# EAGLE design ADC_CPLDV9 (EAGLE 9.3.2)
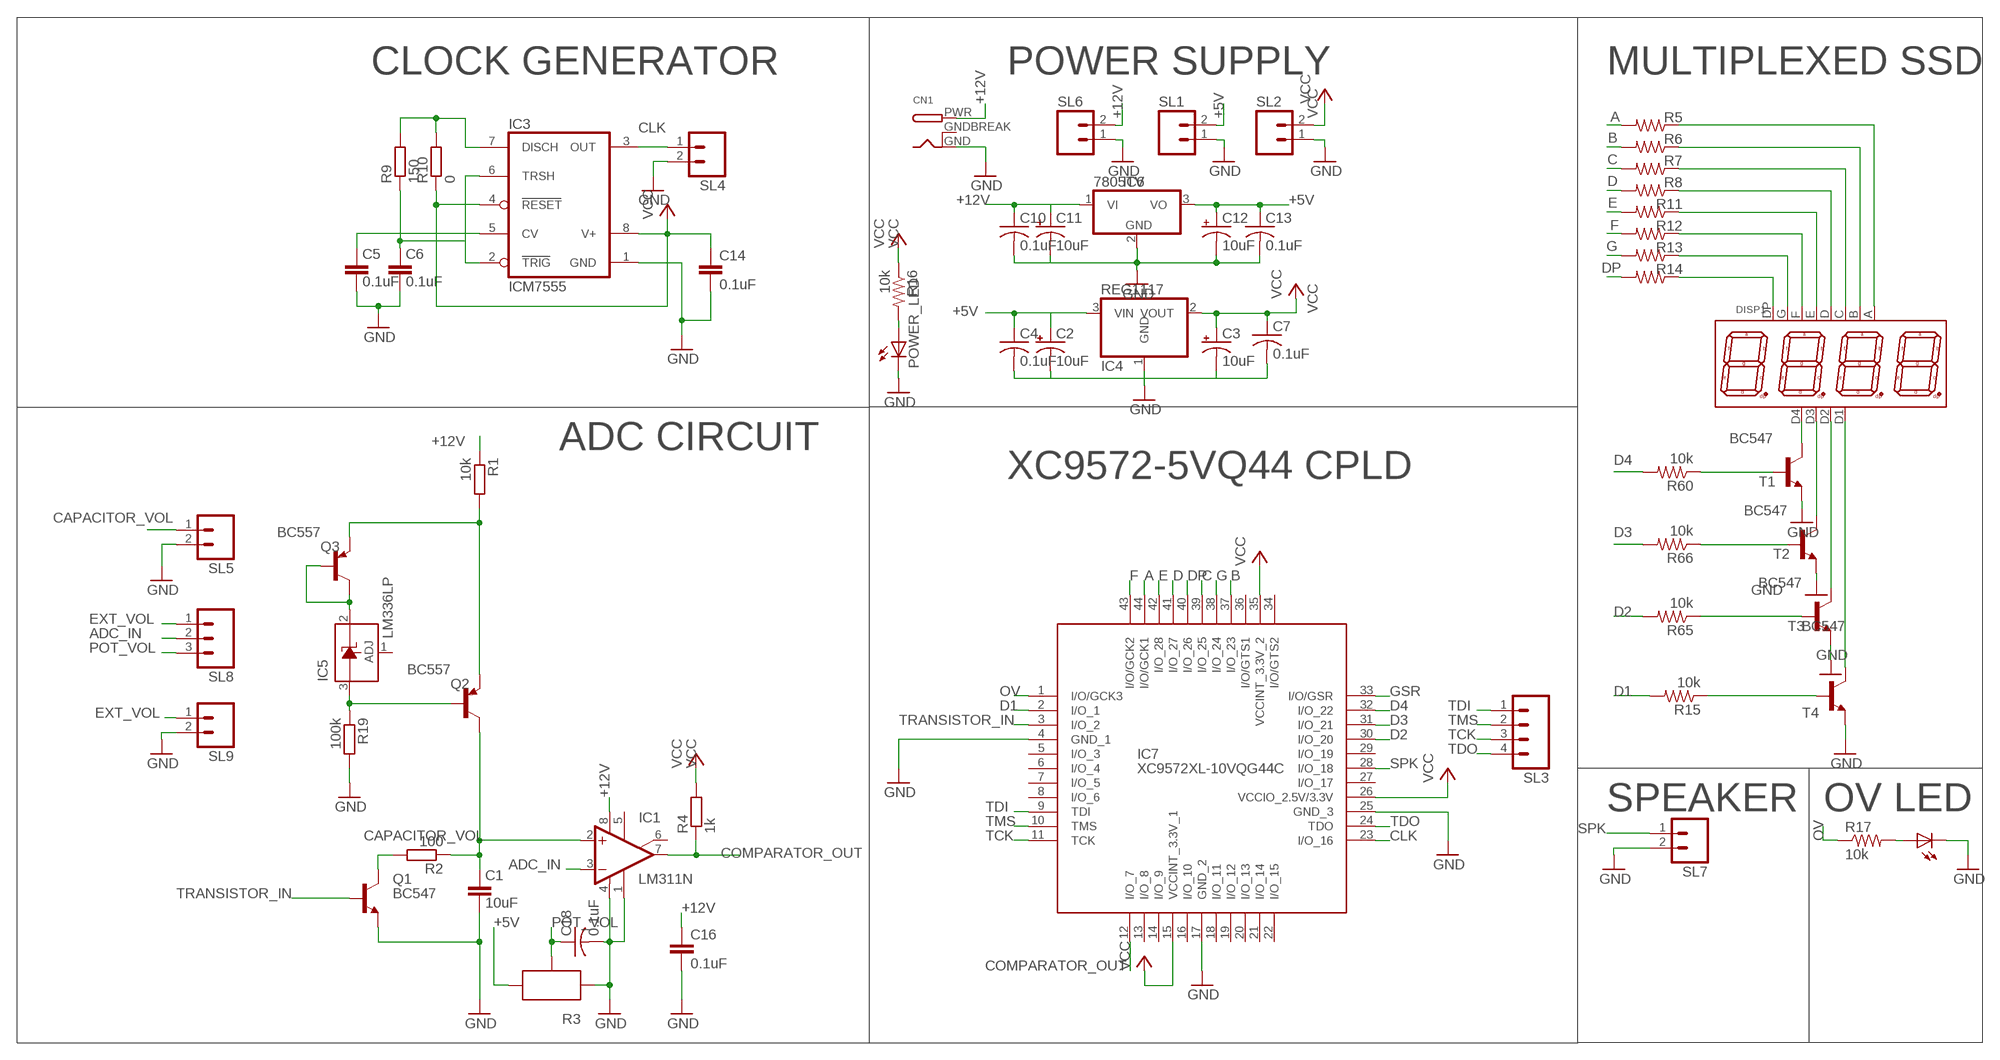
[diagram p0: schematic, sheet 1]

## Parts
C1  10uF  C-EU025-025X050  [C025-025X050]
C2  10uF  CPOL-USB/3528-21R  [B/3528-21R]
C3  10uF  CPOL-USB/3528-21R  [B/3528-21R]
C4  0.1uF  C-USC0805  [C0805]
C5  0.1uF  C-EU025-024X044  [C025-024X044]
C6  0.1uF  C-EU025-024X044  [C025-024X044]
C7  0.1uF  C-USC0805  [C0805]
C10  0.1uF  C-USC0805  [C0805]
C11  10uF  CPOL-USB/3528-21R  [B/3528-21R]
C12  10uF  CPOL-USB/3528-21R  [B/3528-21R]
C13  0.1uF  C-USC0805  [C0805]
C14  0.1uF  C-EU025-025X050  [C025-025X050]
C16  0.1uF  C-EU025-025X050  [C025-025X050]
C18  0.1uF  C-USC0805  [C0805]
CN1  DCBARRELPTH  [DCJACK_2MM_PTH]
DISP1  7-SEG_4D_0.36  [7SEG-4DIG]
IC1  LM311N  [DIL08]
IC3  ICM7555  [DIL08]
IC4  REG1117  [SOT223]
IC5  LM336LP  [TO92]
IC6  7805TV  [TO220V]
IC7  XC9572XL-10VQG44C  [44_PIN_BOB]
POWER_LED  LED3MM  [LED3MM]
POWER_LED1  LED3MM  [LED3MM]
Q1  BC547  [TO92]
Q2  BC557  [TO92]
Q3  BC557  [TO92]
R1  10k  R-EU_0204/7  [0204/7]
R2  100  R-EU_0204/7  [0204/7]
R3  POTNORMAL  [RJ9W]
R4  1k  R-EU_0207/10  [0207/10]
R5  330  R-US_0207/7  [0207/7]
R6  330  R-US_0207/7  [0207/7]
R7  330  R-US_0207/7  [0207/7]
R8  1k  R-US_0207/7  [0207/7]
R9  150  R-EU_0204/7  [0204/7]
R10  0  R-EU_0204/7  [0204/7]
R11  330  R-US_0207/7  [0207/7]
R12  330  R-US_0207/7  [0207/7]
R13  330  R-US_0207/7  [0207/7]
R14  330  R-US_0207/7  [0207/7]
R15  10k  R-US_0207/7  [0207/7]
R16  10k  R-US_0207/7  [0207/7]
R17  10k  R-US_0207/7  [0207/7]
R19  100k  R-EU_0204/7  [0204/7]
R60  10k  R-US_0207/7  [0207/7]
R65  10k  R-US_0207/7  [0207/7]
R66  10k  R-US_0207/7  [0207/7]
SL1  M02  [02P]
SL2  M02  [02P]
SL3  M04  [04P]
SL4  M02  [02P]
SL5  M02  [02P]
SL6  M02  [02P]
SL7  M02  [02P]
SL8  M03  [03P]
SL9  M02  [02P]
T1  BC547  [TO92]
T2  BC547  [TO92]
T3  BC547  [TO92]
T4  BC547  [TO92]

## Nets
+5V: C2.+ C4.1 C12.+ C13.1 IC4.3(VIN) IC6.3(VO) R3.A SL1.2
+12V: C10.1 C11.+ C16.1 CN1.PWR IC1.8(V+) IC6.1(VI) R1.1 SL6.2
A: IC7.44(I/O/GCK1) R5.2
ADC_IN: IC1.3(-IN) SL8.2
B: IC7.37(I/O_23) R6.2
C: IC7.39(I/O_25) R7.2
CAPACITOR_VOL: C1.1 IC1.2(+IN) Q2.3(C) R2.1 SL5.1
CLK: IC3.3(OUT) IC7.23(I/O_16) SL4.1
COMPARATOR_OUT: IC1.7(OUT) IC7.12(I/O_7) R4.1
D: IC7.41(I/O_27) R8.2
D1: IC7.2(I/O_1) R15.2
D2: IC7.30(I/O_20) R65.2
D3: IC7.31(I/O_21) R66.2
D4: IC7.32(I/O_22) R60.2
DP: IC7.40(I/O_26) R14.2
E: IC7.42(I/O_28) R11.2
EXT_VOL: SL8.1 SL9.1
F: IC7.43(I/O/GCK2) R12.2
G: IC7.38(I/O_24) R13.2
GND: C1.2 C2.- C3.- C4.2 C5.2 C6.2 C7.2 C10.2 C11.- C12.- C13.2 C14.2 C16.2 C18.2 CN1.GND IC1.1(GND) IC1.4(V-) IC3.1(GND) IC4.1(GND) IC6.2(GND) IC7.4(GND_1) IC7.17(GND_2) IC7.25(GND_3) POWER_LED1.K(C) POWER_LED.K(C) Q1.1(E) R3.E R19.2 SL1.1 SL2.1 SL4.2 SL5.2 SL6.1 SL7.2 SL9.2 T1.1(E) T2.1(E) T3.1(E) T4.1(E)
GSR: IC7.33(I/O/GSR)
N$1: C6.1 IC3.2(TRIG) IC3.6(TRSH) R9.1
N$3: IC5.3(A) Q2.2(B) R19.1
N$4: Q1.3(C) R2.2
N$5: POWER_LED1.A R17.2
N$7: IC3.7(DISCH) R9.2 R10.2
N$9: C5.1 IC3.5(CV)
N$10: DISP1.D3 T2.3(C)
N$11: DISP1.D2 T3.3(C)
N$12: DISP1.D1 T4.3(C)
N$13: POWER_LED.A R16.2
N$14: DISP1.DP R14.1
N$15: DISP1.G R13.1
N$16: DISP1.F R12.1
N$17: DISP1.E R11.1
N$18: DISP1.D R8.1
N$19: DISP1.C R7.1
N$20: DISP1.B R6.1
N$21: DISP1.A R5.1
N$25: IC5.2(C) Q3.2(B) Q3.3(C)
N$27: Q2.1(E) Q3.1(E) R1.2
N$89: DISP1.D4 T1.3(C)
N$96: R60.1 T1.2(B)
N$97: R66.1 T2.2(B)
N$98: R65.1 T3.2(B)
N$99: R15.1 T4.2(B)
OV: IC7.1(I/O/GCK3) R17.1
POT_VOL: C18.1 R3.S SL8.3
SPK: IC7.28(I/O_18) SL7.1
TCK: IC7.11(TCK) SL3.3
TDI: IC7.9(TDI) SL3.1
TDO: IC7.24(TDO) SL3.4
TMS: IC7.10(TMS) SL3.2
TRANSISTOR_IN: IC7.3(I/O_2) Q1.2(B)
VCC: C3.+ C7.1 C14.1 IC3.4(RESET) IC3.8(V+) IC4.2(VOUT) IC7.15(VCCINT_3.3V_1) IC7.26(VCCIO_2.5V/3.3V) IC7.35(VCCINT_3.3V_2) R4.2 R10.1 R16.1 SL2.2
Unconnected: IC1.5(ON) IC1.6(ON/STR) IC5.1(ADJ) IC7.5(I/O_3) IC7.6(I/O_4) IC7.7(I/O_5) IC7.8(I/O_6) IC7.13(I/O_8) IC7.14(I/O_9) IC7.16(I/O_10) IC7.18(I/O_11) IC7.19(I/O_12) IC7.20(I/O_13) IC7.21(I/O_14) IC7.22(I/O_15) IC7.27(I/O_17) IC7.29(I/O_19) IC7.34(I/O/GTS2) IC7.36(I/O/GTS1)

## Notes on the sheet
- CLOCK GENERATOR | POWER SUPPLY | MULTIPLEXED SSD
- ADC CIRCUIT
- XC9572-5VQ44 CPLD
- SPEAKER | OV LED

## Power pins joined to a net without a drawn wire
GNDBREAK: CN1.GNDBREAK

## Library data of the parts
C1 C5 C6 C14 C16 = rcl:C-EU: CAPACITOR, European symbol; SPICEPREFIX: C
C2 C3 C11 C12 = 01_adafruit:CPOL-US: POLARIZED CAPACITOR, American symbol
C4 C7 C10 C13 C18 = 01_adafruit:C-US: CAPACITOR, American symbol
CN1 = adafruit:DCBARREL: 2.0mm DC Barrel Jack DCJACK_2MM_PTH - Through Hole Jack (4UConnector: 05537)
DISP1 = 7-seg_disp_0.36in:7-SEG_4D_0.36: 7-Segment 4-Digit Display 0.36" (9.11mm) Common Cathode. Created by David J. LEWIS (2015)
IC1 = linear:LM311: COMPARATOR
IC3 = maxim:ICM7555: TIMER; MF: MAXIM; MPN: ICM7555IPA+; OC_FARNELL: 9663762; OC_NEWARK: 68K4387
IC4 = Arduino_Hackathon_v5:REG1117: 800mA and 1A Low Dropout (LDO) Positive Regulator 1.8V, 2.5V, 2.85V, 3.3V, 5V, and Adj
IC5 = linear:LM336: 2.5-V INTEGRATED REFERENCE CIRCUITS LM236 Source: http://focus.ti.com/lit/ds/symlink/lm336-2.5.pdf
IC6 = linear:78*: Positive VOLTAGE REGULATOR Source: http://cache.national.com/ds/LM/LM78L05.pdf http://www.fairchildsemi.com/ds/LM/LM7805.pdf
IC7 = BOB_new:XC9572XL-10VQG44C: XILINX - XC9572XL-10VQG44C - CPLD, 72 MACROCELL, 3.3V, 44VQFP Source: Datasheet <https://componentsearchengine.com/Datasheets/2/XC9572XL-10VQG44C.pdf>
POWER_LED POWER_LED1 = 01_adafruit:LED: LED OSRAM: - CHIPLED LG R971, LG N971, LY N971, LG Q971, LY Q971, LO R971, LY R971 LH N974, LH R974 LS Q976, LO Q976, LY Q976 LO Q996 - Hyper CHIPLED LW Q18S LB Q993, LB Q99A, LB R99A - SideLED LS A670, LO A670, LY A670, LG A670, LP A670 LB A673, LV A673, LT A673, LW A673 LH A674 LY A675 LS A676, LA A676, LO A676, LY A676, LW A676 LS A679, LY A679, LG A679 - Hyper Micro SIDELED® LS Y876, LA Y876, LO Y876, LY Y876 LT Y87S - SmartLED LW L88C, LW L88S LB L89C, LB L89S, LG L890 LS L89K, LO L89K, LY L89K LS L896, LA L896, LO L896, LY L896 - TOPLED LS T670, LO T670, LY T670, LG T670, LP T670 LSG T670, LSP T670, LSY T670, LOP T670, LYG T670 LG T671, LOG T671, LSG T671 LB T673, LV T673, LT T673, LW T673 LH T674 LS T676, LA T676, LO T676, LY T676, LB T676, LH T676, LSB T676, LW T676 LB T67C, LV T67C, LT T67C, LS T67K, LO T67K, LY T67K, LW E67C LS E67B, LA E67B, LO E67B, LY E67B, LB E67C, LV E67C, LT E67C LW T67C LS T679, LY T679, LG T679 LS T770, LO T770, LY T770, LG T770, LP T770 LB T773, LV T773, LT T773, LW T773 LH T774 LS E675, LA E675, LY E675, LS T675 LS T776, LA T776, LO T776, LY T776, LB T776 LHGB T686 LT T68C, LB T68C - Hyper Mini TOPLED® LB M676 - Mini TOPLED Santana® LG M470 LS M47K, LO M47K, LY M47K Source: http://www.osram.convergy.de/
Q1 T1-T4 = transistor:BC547: NPN TRANSISTOR
Q2 Q3 = transistor-pnp:BC557: PNP Transistor
R1 R2 R4 R9 R10 R19 = rcl:R-EU_: RESISTOR, European symbol; SPICEPREFIX: R
R3 = CEDT_JANUARY_2015_v5:POT
R5-R8 R11-R17 R60 R65 R66 = RCL:R-US_: RESISTOR, American symbol
SL1 SL2 SL4-SL7 SL9 = CEDTv81:M02: AMP QUICK CONNECTOR
SL3 = con-amp-quick:M04: AMP QUICK CONNECTOR; OC_FARNELL: unknown; OC_NEWARK: unknown
SL8 = con-amp-quick:M03: AMP QUICK CONNECTOR; OC_FARNELL: unknown; OC_NEWARK: unknown

## Board
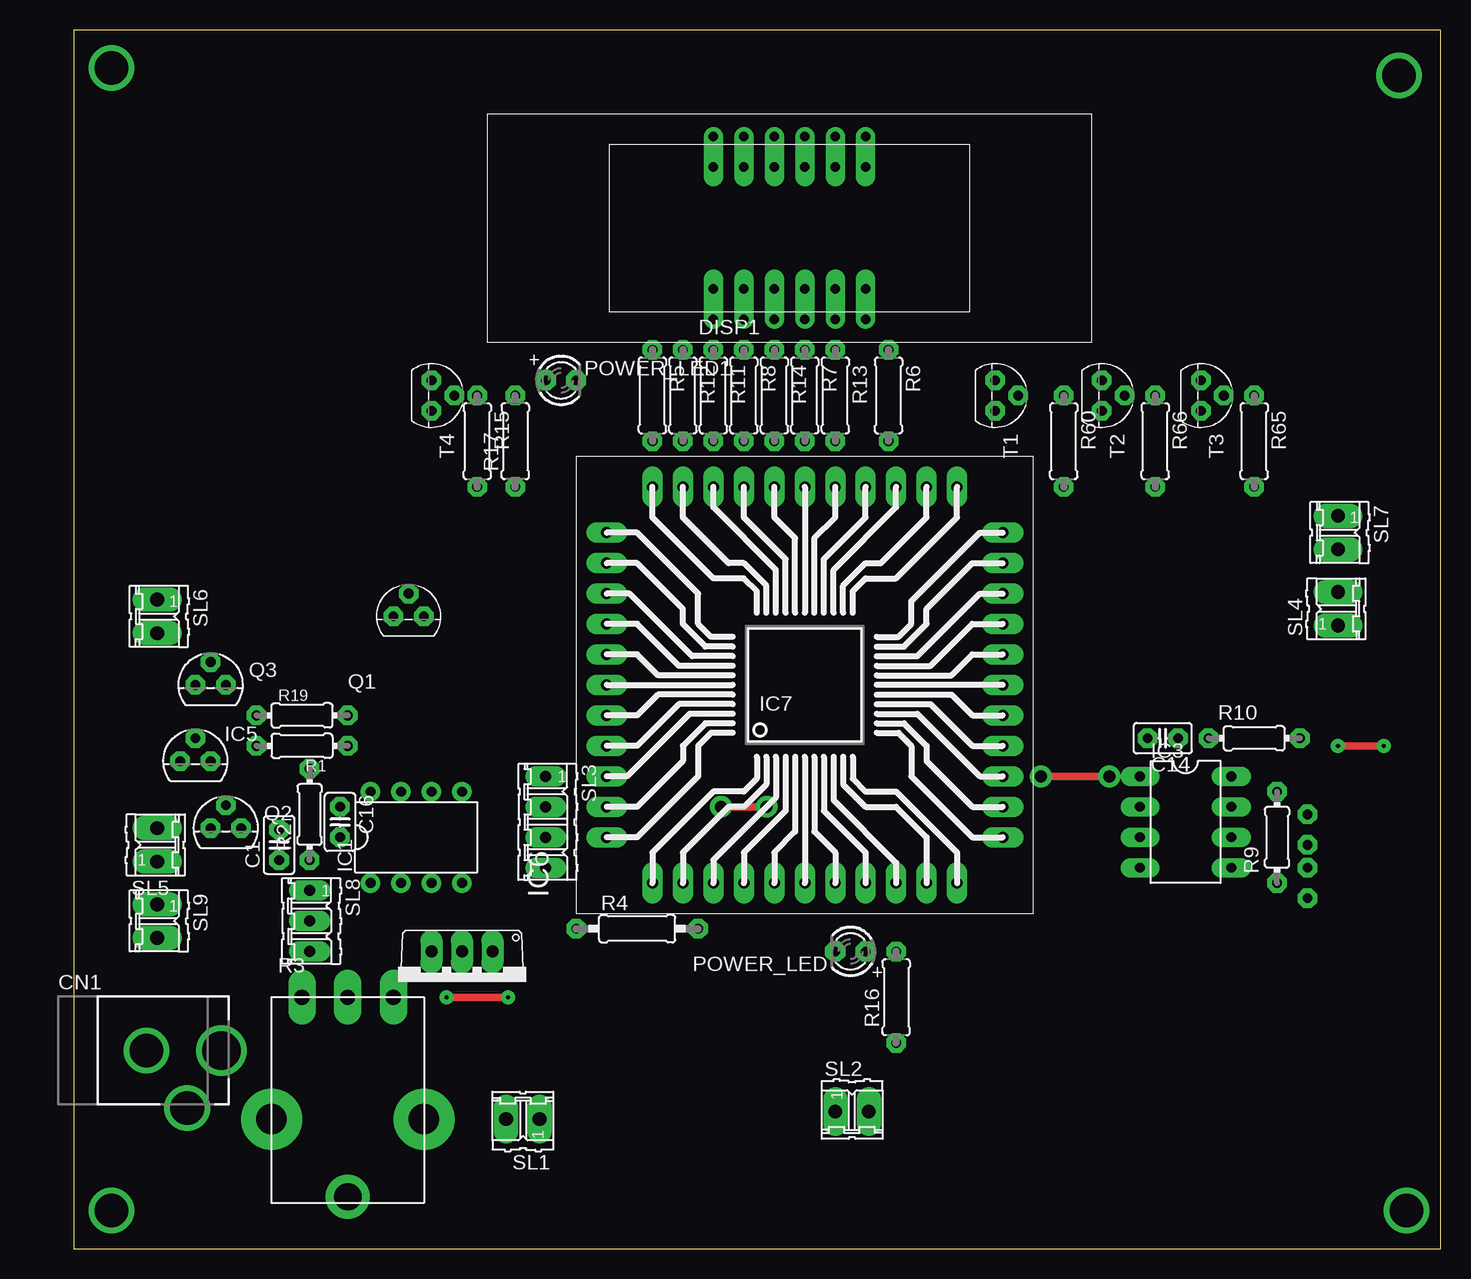
[diagram p1: board, top side]
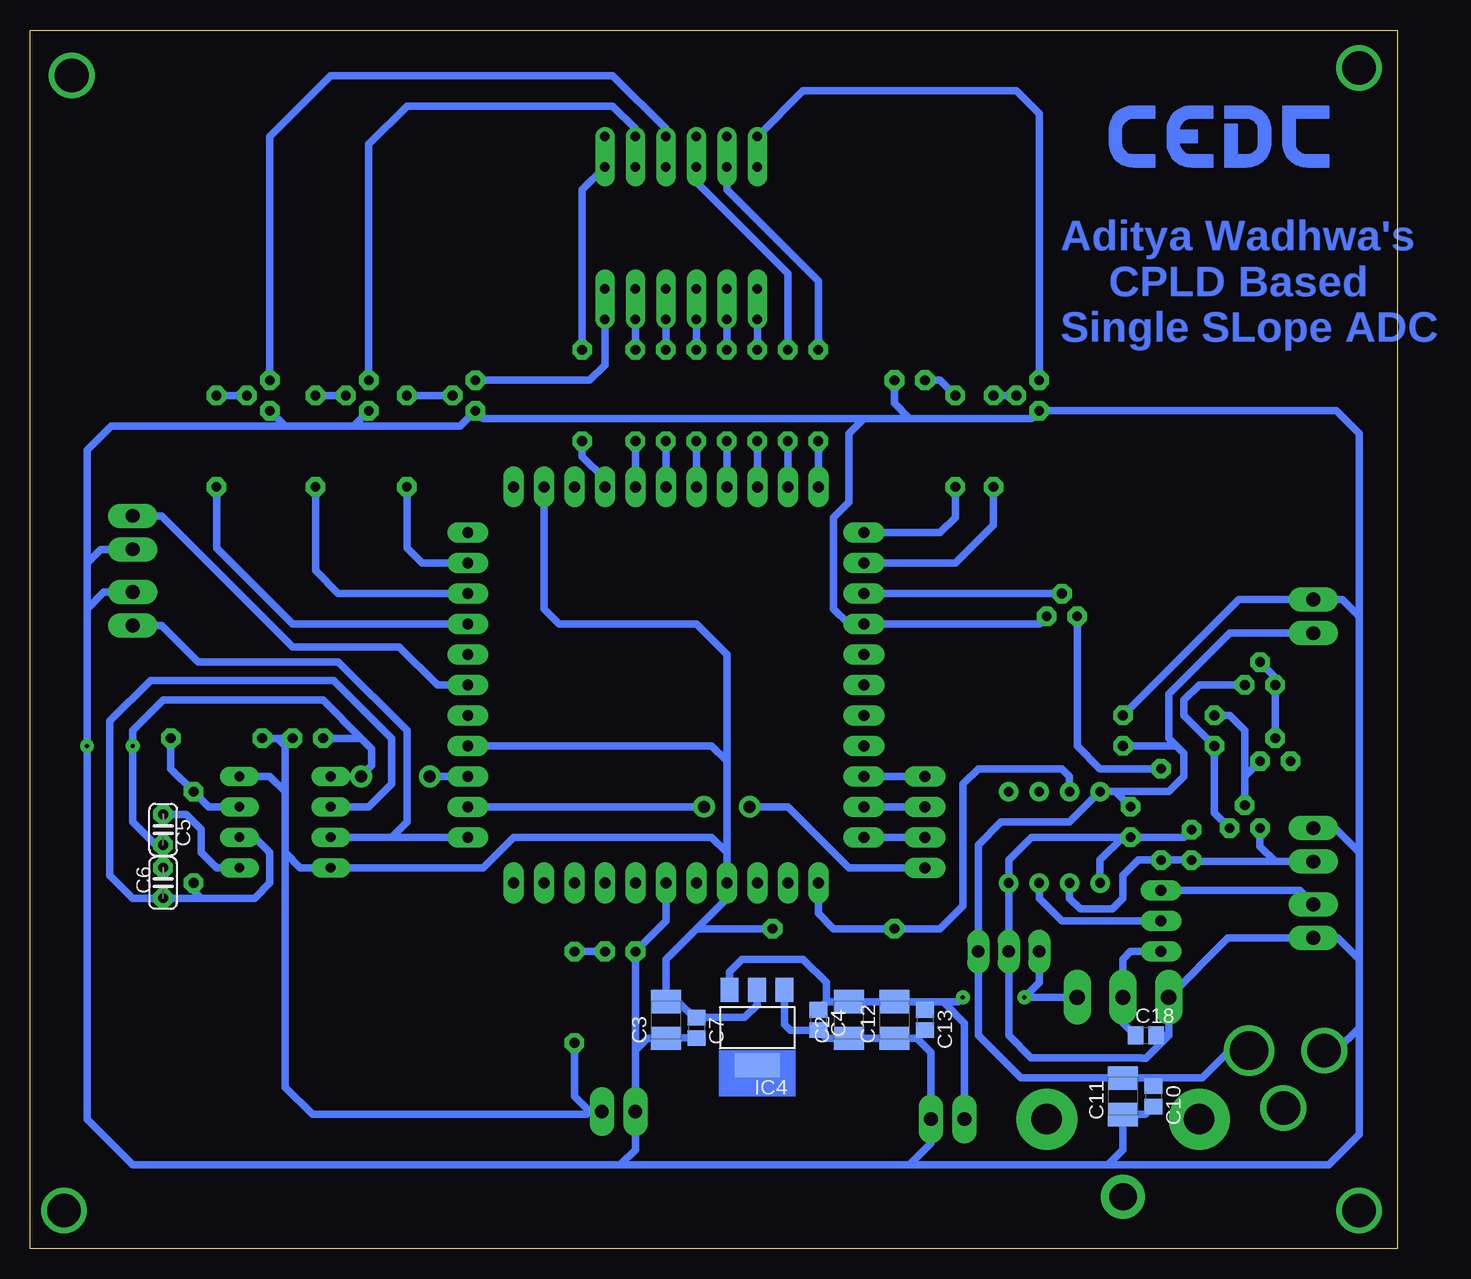
[diagram p2: board, bottom side, seen from below]

Size 113.97 x 101.59 mm. Coordinates in mm from the lower left corner, seen from the top.
Outline: 0,0 113.97,0 113.97,101.59 0,101.59 0,0
Copper layers (1*16): Top 0.035mm / dielectric 1.5mm / Bottom 0.035mm
Design rules "default *": minimum track width 6mil, minimum drill 0.35mm, track to track 16mil, track to pad 16mil, pad to pad 16mil, via to via 16mil, smd to smd 16mil, copper to edge 40mil, drill to drill 6mil, minimum pad ring 16mil, minimum via ring 16mil, stop-mask expansion 4mil, vias tented up to drill 0mil, thermal gap 10mil

### Footprints (pad centres in the part's own frame; a part is rotated, then mirrored left to right if it is on the bottom)
C025-025X050 = drill 0.813 octagon: 1 -1.27,0; 2 1.27,0
B/3528-21R = smd 1.95 x 2.5: + 1.525,0; - -1.525,0
C0805 = smd 1.3 x 1.5: 1 -0.85,0; 2 0.85,0
C025-024X044 = drill 0.813 octagon: 1 -1.27,0; 2 1.27,0
DCJACK_2MM_PTH = drill 2.8: GND 0,7.35; GNDBREAK 4.8,10.75 | drill 3.2: PWR 0,13.6
7SEG-4DIG = drill 0.8 long: A -3.81,5.08; B 6.35,5.08; C 1.27,-5.08; D -3.81,-5.08; D1 -6.35,5.08; D2 1.27,5.08; D3 3.81,5.08; D4 6.35,-5.08; DP -1.27,-5.08; E -6.35,-5.08; F -1.27,5.08; G 3.81,-5.08 | drill 0.8 offset: P$1 6.35,7.62; P$2 3.81,7.62; P$3 1.27,7.62; P$4 -1.27,7.62; P$5 -3.81,7.62; P$6 -6.35,7.62; P$7 -6.35,-7.62; P$8 -3.81,-7.62; P$9 -1.27,-7.62; P$10 1.27,-7.62; P$11 3.81,-7.62; P$12 6.35,-7.62
DIL08 = drill 0.813 pad 1.27: 1 -3.81,-3.81; 2 -1.27,-3.81; 3 1.27,-3.81; 4 3.81,-3.81; 5 3.81,3.81; 6 1.27,3.81; 7 -1.27,3.81; 8 -3.81,3.81
DIL08' = drill 0.813 long: 1 -3.81,-3.81; 2 -1.27,-3.81; 3 1.27,-3.81; 4 3.81,-3.81; 5 3.81,3.81; 6 1.27,3.81; 7 -1.27,3.81; 8 -3.81,3.81
SOT223 = smd 1.499 x 2.007: 1 -2.261,-3.15; 2 0.025,-3.15; 3 2.311,-3.15 | smd 3.81 x 2.007: 4 0,3.15
TO92 = drill 0.813 octagon: 1 -1.27,0; 2 0,1.905; 3 1.27,0
TO220V = drill 1.016 long: 1 -2.54,-2.54; 2 0,-2.54; 3 2.54,-2.54
44_PIN_BOB = drill 0.914 long: 1 -16.51,12.7; 2 -16.51,10.16; 3 -16.51,7.62; 4 -16.51,5.08; 5 -16.51,2.54; 6 -16.51,0; 7 -16.51,-2.54; 8 -16.51,-5.08; 9 -16.51,-7.62; 10 -16.51,-10.16; 11 -16.51,-12.7; 12 -12.7,-16.51; 13 -10.16,-16.51; 14 -7.62,-16.51; 15 -5.08,-16.51; 16 -2.54,-16.51; 17 0,-16.51; 18 2.54,-16.51; 19 5.08,-16.51; 20 7.62,-16.51; 21 10.16,-16.51; 22 12.7,-16.51; 23 16.51,-12.7; 24 16.51,-10.16; 25 16.51,-7.62; 26 16.51,-5.08; 27 16.51,-2.54; 28 16.51,0; 29 16.51,2.54; 30 16.51,5.08; 31 16.51,7.62; 32 16.51,10.16; 33 16.51,12.7; 34 12.7,16.51; 35 10.16,16.51; 36 7.62,16.51; 37 5.08,16.51; 38 2.54,16.51; 39 0,16.51; 40 -2.54,16.51; 41 -5.08,16.51; 42 -7.62,16.51; 43 -10.16,16.51; 44 -12.7,16.51
LED3MM = drill 0.813 pad 1.676 octagon: A -1.27,0; K 1.27,0
TO92' = drill 0.813 octagon: 1 1.27,0; 2 0,1.905; 3 -1.27,0
0204/7 = drill 0.813 octagon: 1 -3.81,0; 2 3.81,0
RJ9W = drill 1.27 long: A 3.81,8.255; E -3.81,8.255; S 0,8.255 | drill 2.286 pad 3.658: P$1 0,-8.382 | drill 2.54 pad 5.08: P$3 6.35,-1.905; P$4 -6.35,-1.905
0207/10 = drill 0.813 octagon: 1 -5.08,0; 2 5.08,0
0207/7 = drill 0.813 octagon: 1 -3.81,0; 2 3.81,0
02P = drill 1.143 long: 1 -1.397,0; 2 1.397,0
04P = drill 0.914 long: 1 -3.81,0; 2 -1.27,0; 3 1.27,0; 4 3.81,0
03P = drill 0.914 long: 1 -2.54,0; 2 0,0; 3 2.54,0

### Placement (x,y rotation side)
C1  17.14,33.66 90 top
C2  45.72,19.05 90 bottom
C3  60.96,19.05 90 bottom
C4  48.26,19.05 270 bottom
C5  102.87,34.92 270 bottom
C6  102.87,30.48 90 bottom
C7  58.42,18.41 270 bottom
C10  20.32,12.7 270 bottom
C11  22.86,12.7 90 bottom
C12  41.91,19.05 90 bottom
C13  39.37,19.05 270 bottom
C14  90.81,42.55 180 top
C16  22.23,35.56 270 top
C18  20.95,17.78 0 bottom
CN1  -1.27,16.51 270 top
DISP1  59.69,85.09 0 top
IC1  28.57,34.29 0 top
IC3  ICM7555  [DIL08']  92.71,35.56 270 top
IC4  53.34,18.41 180 bottom
IC5  10.16,40.64 0 top
IC6  32.38,22.23 180 top
IC7  60.96,46.99 0 top
POWER_LED  64.77,24.77 180 top
POWER_LED1  40.64,72.39 0 top
Q1  BC547  [TO92']  27.94,52.7 0 top
Q2  BC557  [TO92']  12.7,35.05 0 top
Q3  BC557  [TO92']  11.43,46.99 0 top
R1  19.05,41.91 180 top
R2  19.68,36.2 90 top
R3  22.86,12.7 0 top
R4  46.99,26.67 0 top
R5  48.26,71.12 270 top
R6  67.94,71.12 270 top
R7  60.96,71.12 270 top
R8  55.88,71.12 270 top
R9  100.33,34.29 90 top
R10  98.42,42.55 0 top
R11  53.34,71.12 270 top
R12  50.8,71.12 270 top
R13  63.5,71.12 270 top
R14  58.42,71.12 270 top
R15  33.66,67.31 270 top
R16  68.58,20.95 90 top
R17  36.83,67.31 90 top
R19  19.05,44.45 0 top
R60  82.55,67.31 270 top
R65  98.42,67.31 270 top
R66  90.17,67.31 270 top
SL1  37.47,10.79 180 top
SL2  64.9,11.43 0 top
SL3  39.37,35.56 270 top
SL4  105.41,53.34 90 top
SL5  6.99,33.66 90 top
SL6  6.99,52.7 270 top
SL7  105.41,59.69 270 top
SL8  19.68,27.3 270 top
SL9  6.99,27.3 270 top
T1  BC547  [TO92']  76.83,71.12 270 top
T2  BC547  [TO92']  85.72,71.12 270 top
T3  BC547  [TO92']  93.98,71.12 270 top
T4  BC547  [TO92']  29.84,71.12 270 top
U$1  [LOGO-CEDT-BOT-18MM]  5.71,90.17 0 top

### Tracks (layer width: path | path; a pad name or v marks a point on that pad's centre or on a via)
+5V  (via drill 0.35)
  Top 0.61: v36.22,20.95 v31.09,20.95
  Bottom 0.61: C13.1 39.37,20.32 39.62,20.57 | 39.62,20.57 C12.+ C2.+ 47.59,20.57 | 47.59,20.57 C4.1 | 47.59,20.57 47.59,22.18 49.53,24.13 54.61,24.13 55.65,23.09 IC4.3 | 37.84,20.57 39.62,20.57 | SL1.2 36.07,18.8 37.84,20.57 | 37.84,20.57 36.6,20.57 v36.22,20.95 | R3.A v31.09,20.95 29.84,22.2 IC6.3
+12V
  Bottom 0.61: 20.32,14.22 C11.+ 27.94,14.22 28.2,14.22 31.37,14.22 34.92,17.78 IC6.1 34.92,33.66 33.02,35.56 27.3,35.56 IC1.8 23.5,38.1 | 20.32,14.22 16.25,14.22 13.97,16.51 CN1.PWR | C10.1 20.32,14.22 | C16.1 23.5,38.1 | SL6.2 13.97,51.31 19.05,46.23 19.05,42.55 18.41,41.91 | 23.5,38.1 19.05,38.1 17.78,39.37 17.78,41.27 18.41,41.91 | R1.1 18.41,41.91
A
  Bottom 0.61: R5.2 IC7.44
ADC_IN
  Bottom 0.61: SL8.2 27.94,27.3 29.84,29.21 IC1.3
B
  Bottom 0.61: R6.2 67.94,66.04 66.04,64.14 IC7.37
C
  Bottom 0.61: IC7.39 R7.2
CAPACITOR_VOL
  Bottom 0.61: SL5.1 10.16,32.26 | 10.16,32.26 17.02,32.26 C1.1 R2.1 21.59,32.38 22.86,31.11 22.86,29.21 23.75,28.32 26.42,28.32 27.3,29.21 IC1.2 | Q2.3 11.43,33.53 10.16,32.26
CLK
  Bottom 0.61: 83.82,34.29 82.55,35.56 82.55,43.18 88.27,48.9 99.95,48.9 103,51.94 SL4.1 | IC3.3 83.82,34.29 | 83.82,34.29 IC7.23
COMPARATOR_OUT
  Bottom 0.61: IC7.12 48.26,27.94 46.99,26.67 R4.1 38.1,26.67 36.2,28.57 36.2,38.73 34.92,40.01 27.94,40.01 27.3,39.37 IC1.7
D
  Bottom 0.61: R8.2 IC7.41
D1
  Bottom 0.61: R15.2 33.66,60.33 36.83,57.15 IC7.2
D2
  Bottom 0.61: R65.2 98.42,58.42 92.08,52.07 IC7.30
D3
  Bottom 0.61: R66.2 90.17,56.52 88.27,54.61 IC7.31
D4
  Bottom 0.61: R60.2 82.55,58.42 81.28,57.15 IC7.32
DP
  Bottom 0.61: IC7.40 R14.2
E
  Bottom 0.61: R11.2 IC7.42
EXT_VOL
  Bottom 0.61: SL8.1 8.13,29.84 SL9.1
F
  Bottom 0.61: R12.2 IC7.43
G
  Bottom 0.61: IC7.38 R13.2
GND  (via drill 0.35, 1)
  Top 0.61: v86.36,39.37 v80.64,39.37 | v105.41,41.91 v109.22,41.91
  Bottom 0.61: 44.45,69.22 76.2,69.22 T1.1 78.11,68.58 87,68.58 | 44.45,69.22 40.64,69.22 | 40.64,69.22 30.48,69.22 T4.1 5.08,69.85 3.17,67.94 3.17,52.7 | 87,68.58 T2.1 | 92.71,68.58 87,68.58 | 92.71,68.58 T3.1 | C6.2 102.87,33.02 | 102.87,33.02 C5.2 | 102.87,33.02 105.41,35.56 v105.41,41.91 105.41,43.18 102.87,45.72 89.53,45.72 86.36,42.55 | POWER_LED1.K 41.91,70.48 40.64,69.22 | v80.64,39.37 IC7.25 | IC7.17 60.96,27.3 POWER_LED.K 63.5,16.51 | C14.2 86.36,42.55 | 86.36,42.55 85.47,41.66 85.47,40.26 v86.36,39.37 IC3.1 | 40.05,17.52 C13.2 | IC4.1 51.08,18.69 50.59,18.2 C4.2 47.59,17.52 C2.- C12.- 40.05,17.52 | 22.86,34.29 C16.2 17.78,34.29 C1.2 | 22.86,34.29 30.48,34.29 32.38,32.38 IC1.4 IC6.2 32.38,17.78 30.52,15.91 21.32,15.91 21.28,15.88 20.95,15.88 19.05,17.78 | 106.81,58.29 SL7.2 108.08,58.29 109.22,57.15 | 3.17,18.41 5.08,16.51 CN1.GND | 3.17,18.41 3.17,9.53 5.71,6.99 24.13,6.99 | 24.13,6.99 40.64,6.99 | 40.64,6.99 64.77,6.99 | 64.77,6.99 105.41,6.99 109.22,10.79 v109.22,41.91 109.22,53.34 | 40.64,6.99 38.86,8.76 SL1.1 38.86,16.34 40.05,17.52 | 63.5,16.51 SL2.1 63.5,8.26 64.77,6.99 | 24.13,6.99 22.86,8.26 C11.- 21,11.18 C10.2 | 63.5,16.51 62.48,17.52 C3.- 60.92,17.57 C7.2 | 3.17,18.41 3.17,24.13 | 3.17,24.13 3.17,33.02 | SL5.2 5.21,35.05 3.17,33.02 | R19.2 13.21,54.1 SL6.1 4.57,54.1 3.17,52.7 | 3.17,33.02 3.17,52.7 | 3.17,24.13 4.95,25.91 SL9.2 14.1,25.91 R3.E 19.05,17.78 | IC1.1 24.77,32.38 22.86,34.29 | C18.2 19.05,17.78 | 92.71,68.58 107.19,68.58 109.22,66.55 109.22,57.15 | Q1.1 29.84,52.07 IC7.4 45.72,52.07 46.99,53.34 46.99,60.96 45.72,62.23 45.72,67.94 44.45,69.22 | 109.22,53.34 109.22,57.15 | 109.22,53.34 107.82,54.74 SL4.2
N$1
  Bottom 0.61: C6.1 102.45,29.21 | IC3.6 95.25,34.29 93.98,33.02 93.98,30.48 95.25,29.21 99.69,29.21 | 102.45,29.21 105.41,29.21 107.31,31.11 107.31,43.98 103.93,47.37 88.65,47.37 83.82,42.55 83.82,38.73 85.72,36.83 IC3.2 | 99.69,29.21 102.45,29.21 | R9.1 100.33,29.84 99.69,29.21
N$2  (via drill 2.79)
  other vias: 110.49,97.79
N$3
  Bottom 0.61: Q2.2 12.7,39.37 | 12.7,39.37 IC5.3 | 12.7,39.37 12.7,43.18 13.97,44.45 R19.1
N$4
  Bottom 0.61: R2.2 24.77,40.01 26.67,41.91 Q1.3
N$5
  Bottom 0.61: R17.2 38.1,72.39 POWER_LED1.A
N$7
  Bottom 0.61: IC3.7 99.06,36.83 R9.2 102.23,40.01 R10.2
N$8  (via drill 2.79)
  other vias: 111.12,3.17
N$9
  Bottom 0.61: IC3.5 98.42,31.75 99.69,33.02 99.69,34.92 100.97,36.2 C5.1
N$10
  Bottom 0.61: DISP1.D3 63.5,93.34 65.41,95.25 82.55,95.25 85.72,92.08 T2.3
N$11
  Bottom 0.61: DISP1.D2 60.96,93.34 65.41,97.79 88.9,97.79 93.98,92.71 T3.3
N$12
  Bottom 0.61: T4.3 29.84,94.61 31.75,96.52 49.53,96.52 53.34,92.71 DISP1.D1
N$13
  Bottom 0.61: R16.2 POWER_LED.A
N$14
  Bottom 0.61: R14.1 DISP1.DP
N$15
  Bottom 0.61: R13.1 DISP1.G
N$16
  Bottom 0.61: R12.1 50.8,81.28 58.42,88.9 DISP1.F
N$17
  Bottom 0.61: R11.1 DISP1.E
N$18
  Bottom 0.61: R8.1 DISP1.D
N$19
  Bottom 0.61: R7.1 DISP1.C
N$20
  Bottom 0.61: DISP1.B 67.94,88.27 R6.1
N$21
  Bottom 0.61: R5.1 48.26,80.64 55.88,88.27 DISP1.A
N$22  (via drill 2.79)
  other vias: 3.17,3.17
N$23  (via drill 2.79)
  other vias: 3.17,98.42
N$25
  Bottom 0.61: IC5.2 Q3.3 10.16,47.62 Q3.2
N$27
  Bottom 0.61: Q2.1 15.24,36.32 R1.2 17.78,44.45 17.78,45.72 16.51,46.99 Q3.1
N$89
  Bottom 0.61: DISP1.D4 66.04,73.66 67.31,72.39 T1.3
N$96
  Bottom 0.61: T1.2 R60.1
N$97
  Bottom 0.61: T2.2 R66.1
N$98
  Bottom 0.61: T3.2 R65.1
N$99
  Bottom 0.61: R15.1 T4.2
OV
  Bottom 0.61: R17.1 36.83,60.96 38.1,59.69 IC7.1
POT_VOL
  Bottom 0.61: SL8.3 22.23,24.77 22.86,24.13 R3.S 22.86,18.84 C18.1
SPK
  Bottom 0.61: IC7.28 80.01,46.99 83.19,50.16 92.08,50.16 103,61.09 SL7.1
TCK
  Bottom 0.61: IC7.11 SL3.3
TDI
  Bottom 0.61: IC7.9 SL3.1
TDO  (via drill 1)
  Top 0.61: v53.98,36.83 v57.78,36.83
  Bottom 0.61: v53.98,36.83 50.8,36.83 45.72,31.75 SL3.4 | v57.78,36.83 IC7.24
TMS
  Bottom 0.61: IC7.10 SL3.2
TRANSISTOR_IN
  Bottom 0.61: Q1.2 IC7.3
VCC
  Bottom 0.61: 92.71,33.02 91.44,31.75 IC3.4 76.2,31.75 73.66,34.29 57.15,34.29 55.88,33.02 | 92.71,33.02 92.71,38.1 | 92.71,38.1 93.98,39.37 IC3.8 | 58.42,26.67 R4.2 | IC7.35 71.12,53.34 69.85,52.07 58.42,52.07 55.88,49.53 55.88,40.64 | 55.88,33.02 IC7.15 55.88,29.21 58.42,26.67 | 55.88,33.02 55.88,40.64 | 55.88,40.64 57.15,41.91 IC7.26 | 92.71,38.1 92.71,41.91 93.34,42.55 R10.1 C14.1 | SL2.2 67.31,11.43 | 67.31,11.43 68.58,12.7 R16.1 | 67.31,11.43 67.56,11.18 90.42,11.18 92.71,13.46 92.71,33.02 | IC4.2 53.37,20.34 53.34,20.32 54.4,19.27 C7.1 58.63,19.27 59.95,20.57 C3.+ 60.96,24.13 58.42,26.67
(copper drawn outside any net)
  shapes: Bottom area x1

### Text on the board
Bottom: Aditya Wadhwa's / CPLD Based / Single SLope ADC